# EAGLE schematic lpc1114_LCD (EAGLE 7.5.0)
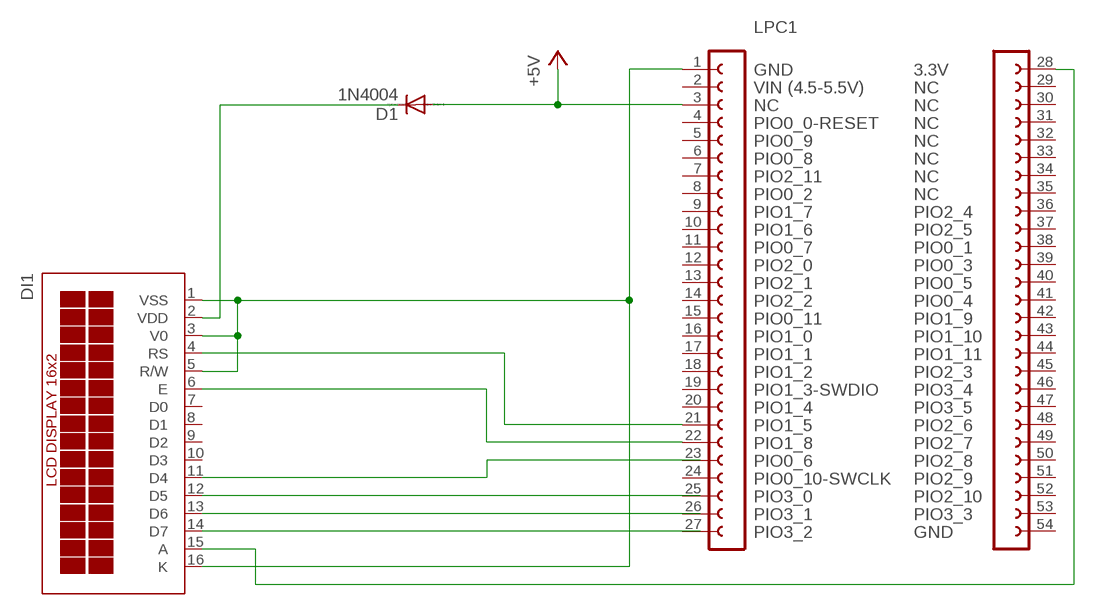
[diagram p0: schematic, sheet 1]

## Parts
D1  1N4004  [DO41-10]
DI1  DISPLAY_  [HD44780_PC]
LPC1  LPCXPRESSO_LPC1114  [LPCXPRESSO_LPC1114]

## Nets
+5V: D1.A LPC1.3
N$1: DI1.14(D7)
N$2: DI1.13(D6)
N$3: DI1.12(D5)
N$4: DI1.11(D4)
N$5: DI1.6(E) LPC1.22
N$6: DI1.4(RS) LPC1.21
N$8: DI1.1(VSS) DI1.3(V0) DI1.5(R/W) DI1.16(K) LPC1.1
N$9: DI1.15(A) LPC1.28
N$11: D1.C DI1.2(VDD)
Unconnected: DI1.7(D0) DI1.8(D1) DI1.9(D2) DI1.10(D3) LPC1.2 LPC1.4 LPC1.5 LPC1.6 LPC1.7 LPC1.8 LPC1.9 LPC1.10 LPC1.11 LPC1.12 LPC1.13 LPC1.14 LPC1.15 LPC1.16 LPC1.17 LPC1.18 LPC1.19 LPC1.20 LPC1.23 LPC1.24 LPC1.25 LPC1.26 LPC1.27 LPC1.29 LPC1.30 LPC1.31 LPC1.32 LPC1.33 LPC1.34 LPC1.35 LPC1.36 LPC1.37 LPC1.38 LPC1.39 LPC1.40 LPC1.41 LPC1.42 LPC1.43 LPC1.44 LPC1.45 LPC1.46 LPC1.47 LPC1.48 LPC1.49 LPC1.50 LPC1.51 LPC1.52 LPC1.53 LPC1.54

## Library data of the parts
D1 = diode:1N4004: DIODE general purpose rectifier, 1 A
DI1 = display-lcd:DISPLAY_
LPC1 = LPCXpresso_boards:LPCXPRESSO_LPC1114